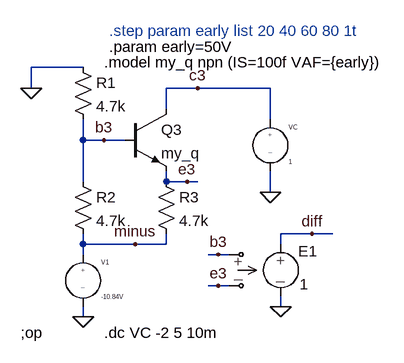
[diagram p0: schematic i-quelle.asc]
i-quelle.asc, the LTspice schematic file:
Version 4
SHEET 1 880 680
WIRE 176 16 96 16
WIRE 96 48 96 16
WIRE 352 48 304 48
WIRE 464 48 352 48
WIRE 304 80 304 48
WIRE 464 96 464 48
WIRE 176 128 176 96
WIRE 208 128 176 128
WIRE 240 128 208 128
WIRE 176 192 176 128
WIRE 304 192 304 176
WIRE 336 192 304 192
WIRE 352 192 336 192
WIRE 464 208 464 176
WIRE 528 272 480 272
WIRE 560 272 528 272
WIRE 176 288 176 272
WIRE 256 288 176 288
WIRE 304 288 304 272
WIRE 304 288 256 288
WIRE 480 288 480 272
WIRE 176 304 176 288
WIRE 384 304 368 304
WIRE 400 304 384 304
WIRE 384 352 368 352
WIRE 400 352 384 352
WIRE 480 384 480 368
WIRE 176 400 176 384
FLAG 96 48 0
FLAG 176 400 0
FLAG 256 288 minus
FLAG 208 128 b3
FLAG 464 208 0
FLAG 336 192 e3
FLAG 480 384 0
FLAG 528 272 diff
FLAG 384 304 b3
FLAG 384 352 e3
FLAG 352 48 c3
SYMBOL res 160 0 R0
SYMATTR InstName R1
SYMATTR Value 4.7k
SYMBOL res 160 176 R0
SYMATTR InstName R2
SYMATTR Value 4.7k
SYMBOL res 288 176 R0
SYMATTR InstName R3
SYMATTR Value 4.7k
SYMBOL EIT_Semiconductors\\npn 240 80 R0
SYMATTR InstName Q3
SYMATTR Value my_q
SYMBOL source-V 176 288 R0
SYMATTR InstName V1
SYMATTR Value -10.84V
SYMBOL source-V 464 80 R0
SYMATTR InstName VC
SYMATTR Value 1
SYMBOL crtl-V-V 480 272 R0
SYMATTR InstName E1
SYMATTR Value 1
TEXT 80 424 Left 2 !;op
TEXT 208 424 Left 2 !.dc VC -2 5 10m
TEXT 208 8 Left 2 !.model my_q npn (IS=100f VAF={early})
TEXT 216 -16 Left 2 !.param early=50V
TEXT 216 -40 Left 2 ;.step param early list 20 40 60 80 1t

The netlist it stands for:
* i-quelle.asc
R1 0 b3 4.7k
R2 b3 minus 4.7k
R3 e3 minus 4.7k
Q3 c3 b3 e3 0 my_q
V1 minus 0 -10.84V
VC c3 0 1
E1 diff 0 b3 e3 1
.model NPN NPN
.model PNP PNP
.lib standard.bjt
;op
.dc VC -2 5 10m
.model my_q npn (IS=100f VAF={early})
.param early=50V
* .step param early list 20 40 60 80 1t
.backanno
.end